# EAGLE design Segway_IMU_v10 (EAGLE 6.2)
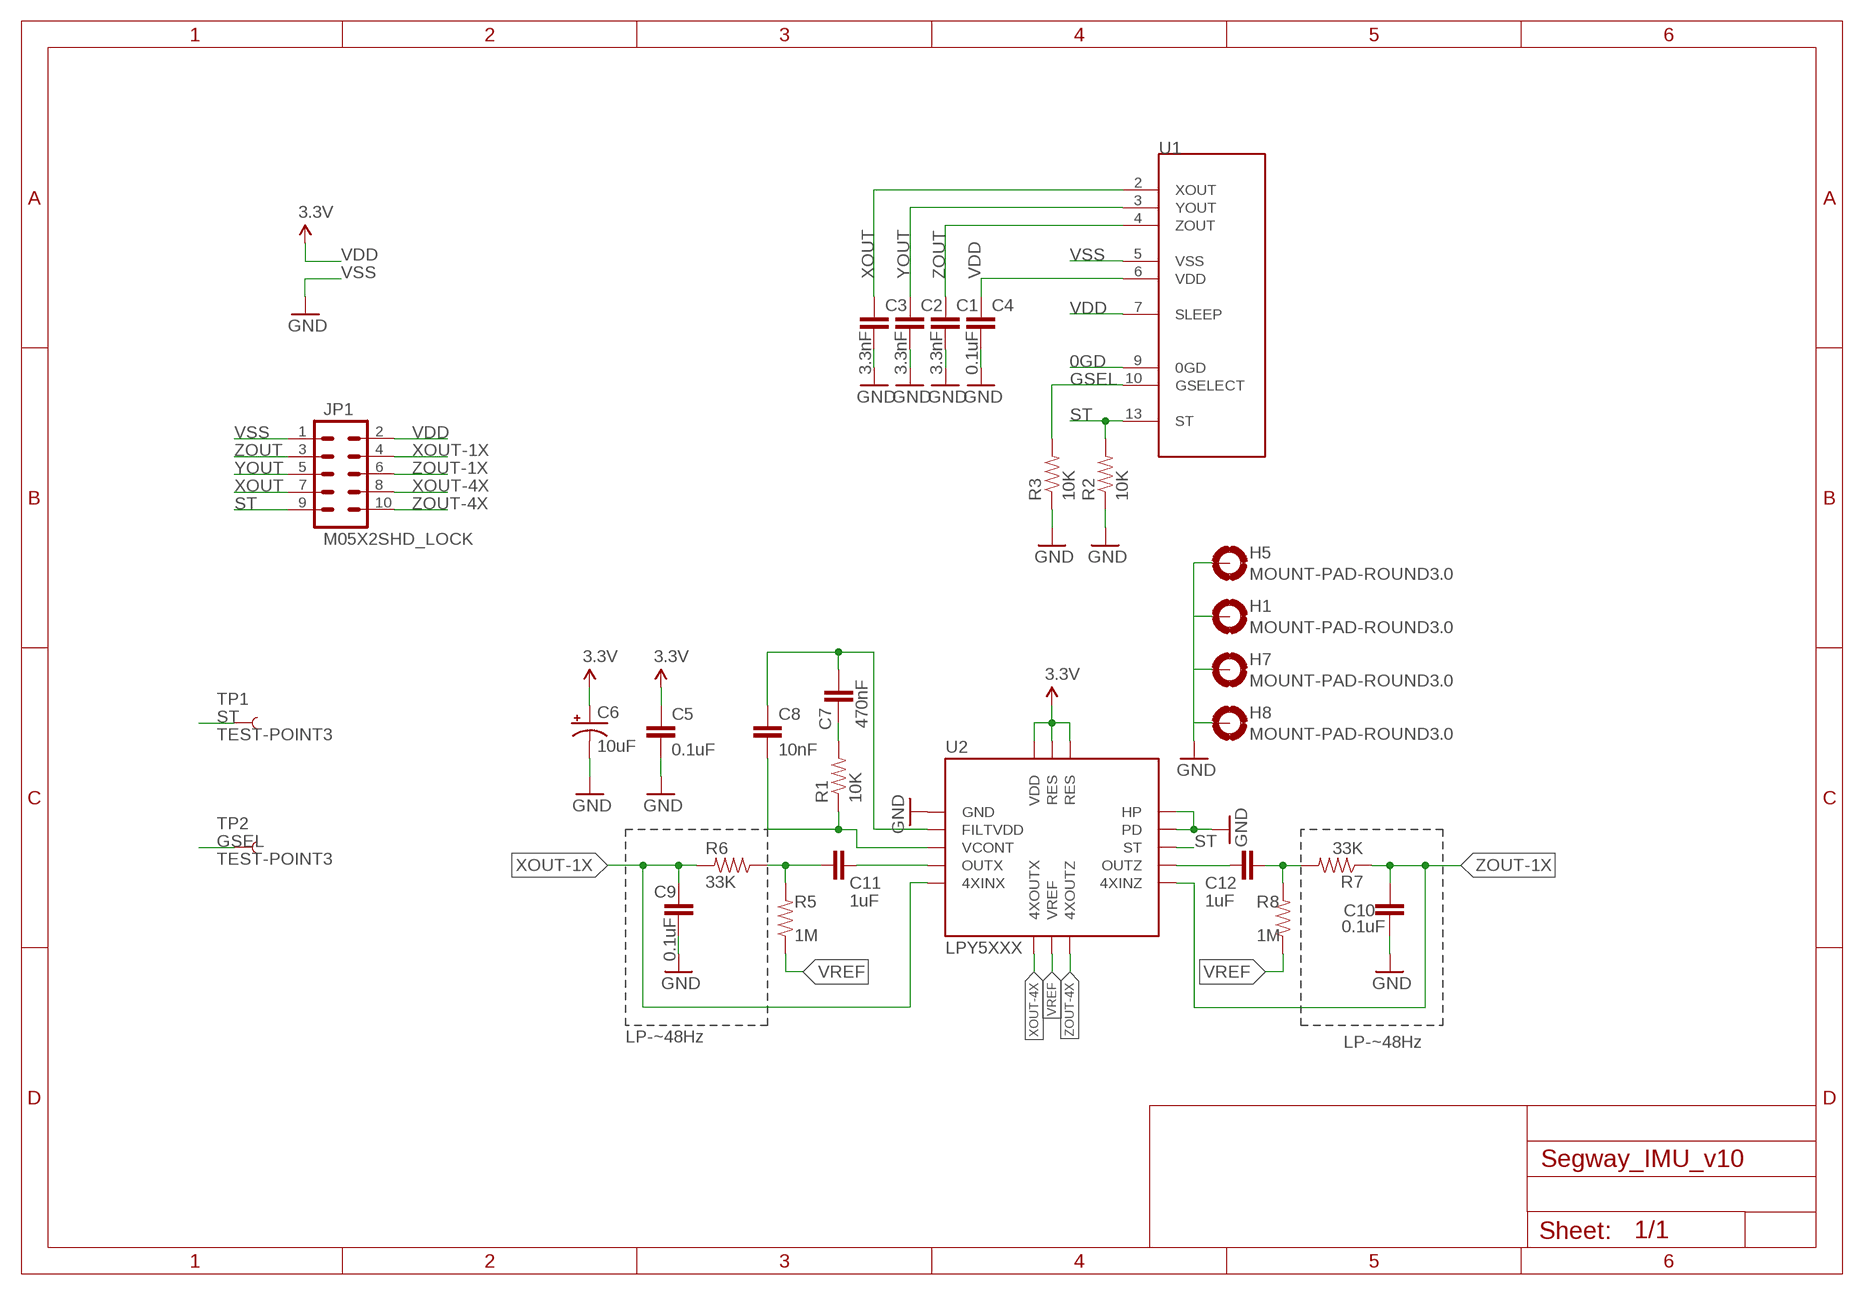
[diagram p0: schematic, sheet 1]

## Parts
C1  3.3nF  CAP0402-CAP  [0402-CAP]
C2  3.3nF  CAP0402-CAP  [0402-CAP]
C3  3.3nF  CAP0402-CAP  [0402-CAP]
C4  0.1uF  CAP0402-CAP  [0402-CAP]
C5  0.1uF  CAP0402-CAP  [0402-CAP]
C6  10uF  CAP_POL1206  [EIA3216]
C7  470nF  CAP0402-CAP  [0402-CAP]
C8  10nF  CAP0402-CAP  [0402-CAP]
C9  0.1uF  CAP0402-CAP  [0402-CAP]
C10  0.1uF  CAP0402-CAP  [0402-CAP]
C11  1uF  CAP0402  [0402]
C12  1uF  CAP0402  [0402]
H1  MOUNT-PAD-ROUND3.0  [3,0-PAD]
H5  MOUNT-PAD-ROUND3.0  [3,0-PAD]
H7  MOUNT-PAD-ROUND3.0  [3,0-PAD]
H8  MOUNT-PAD-ROUND3.0  [3,0-PAD]
JP1  M05X2SHD_LOCK  [2X5-SHROUDED_LOCK]
R1  10K  RESISTOR0402-RES  [0402-RES]
R2  10K  RESISTOR0402-RES  [0402-RES]
R3  10K  RESISTOR0402-RES  [0402-RES]
R5  1M  RESISTOR0402-RES  [0402-RES]
R6  33K  RESISTOR0402-RES  [0402-RES]
R7  33K  RESISTOR0402-RES  [0402-RES]
R8  1M  RESISTOR0402-RES  [0402-RES]
TP1  TEST-POINT3  [PAD.03X.03]
TP2  TEST-POINT3  [PAD.03X.03]
U1  MMA7361  [LGA14]
U2  LPY5XXX  ST-GYRO-PYSMD  [ST-GYRO]

## Nets
0GD: U1.9(0GD)
F1: C7.1 C8.1 U2.2(FILTVDD)
F2: C8.2 R1.1 U2.3(VCONT)
GSEL: R3.2 TP2.P$1 U1.10(GSELECT)
N$1: C11.2 U2.4(OUTX)
N$2: C10.2
N$6: C11.1 R5.2 R6.1
N$7: C7.2 R1.2
N$8: C12.1 U2.10(OUTZ)
N$17: C12.2 R7.2 R8.2
ST: JP1.9 R2.2 TP1.P$1 U1.13(ST) U2.11(ST)
VDD: C4.1 C5.1 C6.A(+) JP1.2 U1.6(VDD) U1.7(SLEEP) U2.14(RES) U2.15(RES) U2.16(VDD) ; supply symbol labelled 3.3V
VREF: R5.1 R8.1 U2.7(VREF)
VSS: C1.2 C2.2 C3.2 C4.2 C5.2 C6.C(-) C9.1 C10.1 H1.B3,0(MOUNT) H5.B3,0(MOUNT) H7.B3,0(MOUNT) H8.B3,0(MOUNT) JP1.1 R2.1 R3.1 U1.5(VSS) U2.1(GND) U2.12(PD) U2.13(HP) ; supply symbol labelled GND
XOUT: C3.1 JP1.7 U1.2(XOUT)
XOUT-1X: C9.2 JP1.4 R6.2 U2.5(4XINX)
XOUT-4X: JP1.8 U2.6(4XOUTX)
YOUT: C2.1 JP1.5 U1.3(YOUT)
ZOUT: C1.1 JP1.3 U1.4(ZOUT)
ZOUT-1X: JP1.6 R7.1 U2.9(4XINZ)
ZOUT-4X: JP1.10 U2.8(4XOUTZ)

## Notes on the sheet
- LP-~48Hz
- LP-~48Hz

## Library data of the parts
C1-C5 C7-C10 = SparkFun:CAP: Capacitor Standard 0603 ceramic capacitor, and 0.1" leaded capacitor.
C6 = SparkFun:CAP_POL: Capacitor Polarized These are standard SMD and PTH capacitors. Normally 10uF, 47uF, and 100uF in electrolytic and tantalum varieties. Always verify the external diameter of the through hole cap, it varies with capacity, voltage, and manufacturer. The EIA devices should be standard.
C11 C12 = gary:CAP: Capacitor Standard 0603 ceramic capacitor, and 0.1" leaded capacitor.
H1 H5 H7 H8 = holes:MOUNT-PAD-ROUND: MOUNTING PAD, round
JP1 = SparkFun:M05X2: Header 5x2 Standard 10-pin dual row 0.1" header. Commonly used with AVR-ISP. Use with Spark Fun Electronics SKU: PRT-00778
R1-R3 R5-R8 = SparkFun:RESISTOR: Resistor Basic schematic elements and footprints for 0603, 1206, and PTH resistors.
TP1 TP2 = SparkFun:TEST-POINT
U1 = SparkFun:MMA7361
U2 = SparkFun:ST-GYRO-PY

## Board
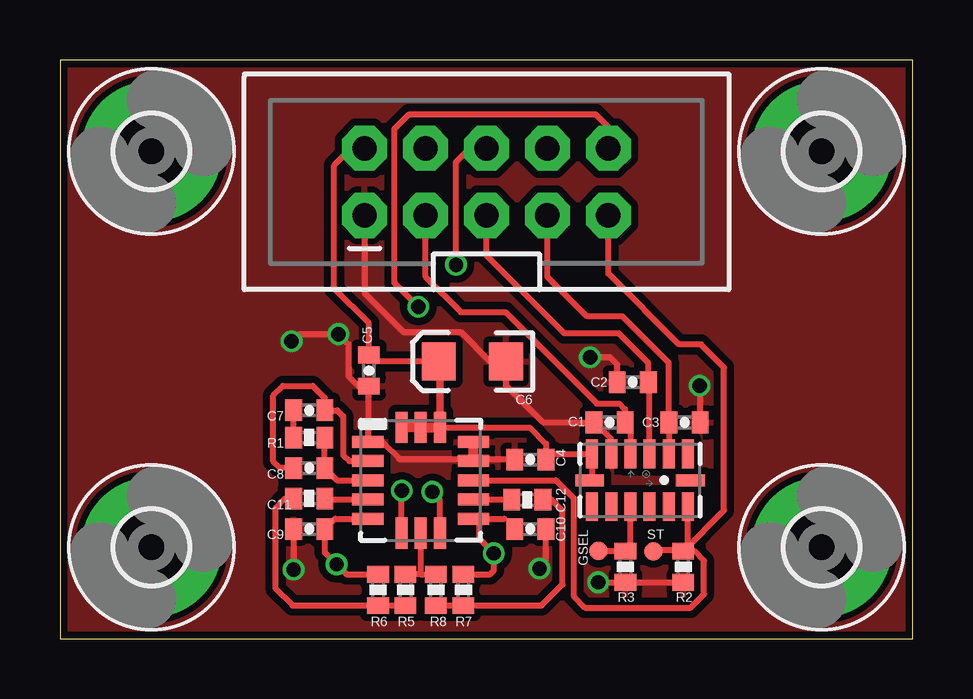
[diagram p1: board, top side]
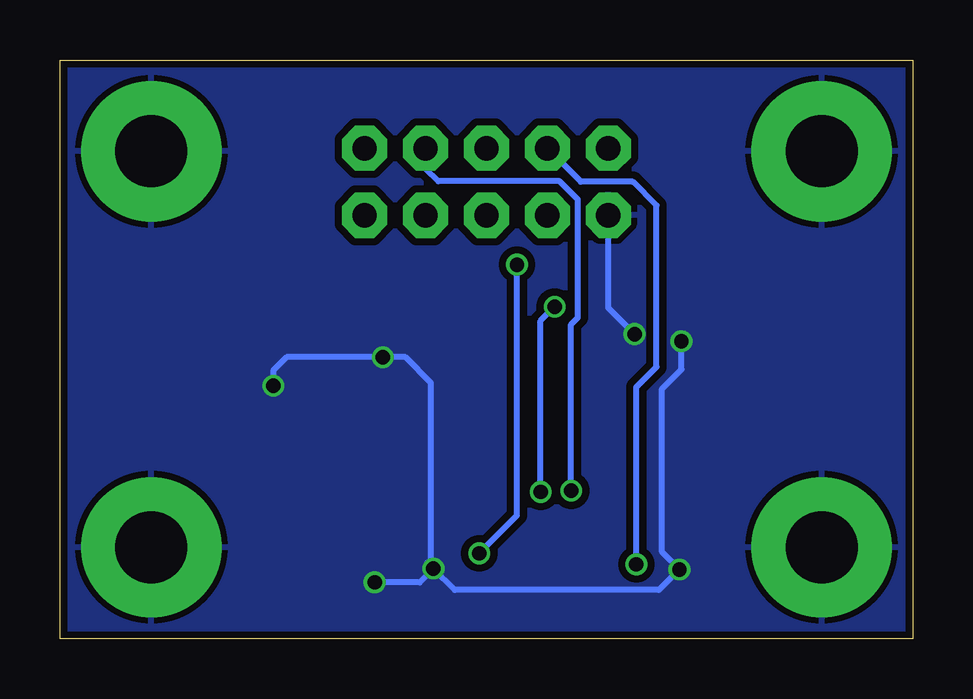
[diagram p2: board, bottom side, seen from below]

Size 35.56 x 24.13 mm. Coordinates in mm from the lower left corner, seen from the top.
Outline: 0,0 35.56,0 35.56,24.13 0,24.13 0,0
Copper layers (1*16): Top 0.035mm / dielectric 1.5mm / Bottom 0.035mm
Design rules: minimum track width 6mil, minimum drill 12mil, track to track 6mil, track to pad 6mil, pad to pad 6mil, via to via 6mil, smd to smd 0mil, copper to edge 10mil, drill to drill 10mil, minimum pad ring 10mil, minimum via ring 6mil, stop-mask expansion 2mil, vias tented up to drill 100mil, thermal gap 10mil

### Footprints (pad centres in the part's own frame; a part is rotated, then mirrored left to right if it is on the bottom)
0402-CAP = smd 0.7 x 0.9: 1 -0.65,0; 2 0.65,0
EIA3216 = smd 1.4 x 1.6: A 1.4,0; C -1.4,0
0402 = smd 0.7 x 0.9: 1 -0.65,0; 2 0.65,0
3,0-PAD = drill 3 pad 5.842: B3,0 0,0
2X5-SHROUDED_LOCK = drill 1.016 pad 1.88 octagon: 1 -1.397,5.08; 2 1.397,5.08; 3 -1.397,2.54; 4 1.397,2.54; 5 -1.397,0; 6 1.397,0; 7 -1.397,-2.54; 8 1.397,-2.54; 9 -1.397,-5.08; 10 1.397,-5.08
0402-RES = smd 0.7 x 0.9: 1 -0.65,0; 2 0.65,0
PAD.03X.03 = smd 0.762 x 0.762: P$1 0,0
LGA14 = smd 0.5 x 1.2: 1 2,1.1; 2 1.2,1.1; 3 0.4,1.1; 4 -0.4,1.1; 5 -1.2,1.1; 6 -2,1.1; 8 -2,-1.1; 9 -1.2,-1.1; 10 -0.4,-1.1; 11 0.4,-1.1; 12 1.2,-1.1; 13 2,-1.1 | smd 1.2 x 0.5: 7 -2.1,0; 14 2.1,0
ST-GYRO = smd 1.3 x 0.5: 1 -2.2,1.6; 2 -2.2,0.8; 3 -2.2,0; 4 -2.2,-0.8; 5 -2.2,-1.6; 9 2.2,-1.6; 10 2.2,-0.8; 11 2.2,0; 12 2.2,0.8; 13 2.2,1.6 | smd 0.5 x 1.3: 6 -0.8,-2.2; 7 0,-2.2; 8 0.8,-2.2; 14 0.8,2.2; 15 0,2.2; 16 -0.8,2.2

### Placement (x,y rotation side)
C1  22.91,9.02 180 top
C2  23.88,10.69 180 top
C3  26.04,9.02 0 top
C4  19.61,7.47 180 top
C5  12.88,11.18 270 top
C6  17.2,11.56 180 top
C7  10.39,9.53 180 top
C8  10.39,7.11 0 top
C9  10.39,4.57 0 top
C10  19.61,4.57 180 top
C11  10.39,5.84 0 top
C12  19.48,5.79 0 top
H1  31.75,20.32 0 top
H5  3.81,20.32 0 top
H7  3.81,3.81 0 top
H8  31.75,3.81 0 top
JP1  17.78,19.05 90 top
R1  10.39,8.38 180 top
R2  25.98,3 90 top
R3  23.57,3 90 top
R5  14.4,2.03 270 top
R6  13.26,2.03 90 top
R7  16.81,2.03 270 top
R8  15.67,2.03 270 top
TP1  24.74,3.65 0 top
TP2  22.45,3.66 0 top
U1  24.18,6.6 0 top
U2  15.04,6.6 0 top

### Tracks (layer width: path | path; a pad name or v marks a point on that pad's centre or on a via)
F1
  Top 0.254: C7.1 11.02,9.54 | U2.2 12.05,7.4 11.81,7.64 11.81,9.27 11.56,9.53 C7.1 | C7.1 11.04,10.04 10.54,10.54 9.3,10.54 8.89,10.13 8.89,7.39 9.17,7.11 C8.1
F2
  Top 0.254: R1.1 C8.2 11.55,6.6 U2.3
GSEL
  Top 0.254: R3.2 23.55,3.67 | U1.10 23.78,3.86 R3.2 | TP2.P$1 R3.2
N$1
  Top 0.254: U2.4 11.08,5.8 C11.2
N$6
  Top 0.254: R5.2 R6.1 9.69,1.38 8.99,2.08 8.99,5.46 9.37,5.84 C11.1
N$7
  Top 0.254: R1.2 C7.2
N$8
  Top 0.254: 18.95,5.8 C12.1 18.82,5.8 U2.10
N$17
  Top 0.254: R8.2 R7.2 20.08,1.38 20.95,2.26 20.95,5.33 20.5,5.79 C12.2
ST
  Top 0.254: R2.2 | R2.2 25.95,3.68 24.77,3.68 TP1.P$1 | U1.13 26.18,3.84 26,3.66 | 26,3.66 R2.2 | U2.11 20.68,6.6 21.41,5.87 21.41,1.78 21.89,1.29 26.29,1.29 26.85,1.85 26.85,3.25 26.44,3.66 26,3.66 | JP1.9 22.86,15.21 25.81,12.27 26.72,12.27 27.69,11.3 27.69,5.35 R2.2
VDD
  Top 0.254: 15.8,8.84 U2.14 19.59,8.8 20.27,8.13 C4.1 20.5,7.7 U1.6 22.18,6.7 U1.7 | C6.A 13.15,11.56 C5.1 12.88,13.16 11.43,14.61 11.43,19.74 12.14,20.45 JP1.2
  Top 0.305: C6.A 15.84,11.56 U2.14
  Top 0.406: U2.16 U2.15 U2.14
VREF
  Top 0.254: 15.04,2.68 R8.1 | 15.04,2.68 R5.1 | U2.7 15.04,2.68
VSS  (via drill 0.6)
  Top 0.254: 16.94,7.49 14.15,7.49 13.44,8.2 U2.1 12.84,10.48 C5.2 12.44,10.53 12.04,10.92 12.04,12.27 v11.61,12.7 9.96,12.7 v9.65,12.39 | 16.94,7.49 17.15,7.49 | R3.1 R2.1 | 16.94,7.49 17.03,7.4 U2.12 17.33,7.49 18.93,7.49 C4.2 | R3.1 23.56,2.36 | C10.1 20.26,3.19 v19.99,2.92 | v22.44,2.35 R3.1 | 26.72,9.05 C3.2 26.68,10.53 v26.67,10.54 | U1.5 22.98,8.3 C1.2 20.14,9.02 18.59,10.57 C6.C 17.93,11.56 16.71,12.78 14.33,12.78 12.7,14.4 JP1.1 | C2.2 23.23,11.45 22.94,11.73 v22.1,11.73 | C9.1 v9.74,2.88
  Top 0.406: U2.12 U2.13
  Bottom 0.254: v19.99,2.92 19.1,2.03 10.59,2.03 v9.74,2.88 10.46,3.61 10.46,10.41 9.65,11.23 v9.65,12.39 | v19.99,2.92 20.24,3.17 | v19.99,2.92 20.09,3.02 20.09,10.67 21.16,11.73 v22.1,11.73 26.11,11.73 26.67,11.18 v26.67,10.54 | JP1.1 12.7,13.79 v11.61,12.7 | v22.44,2.35 20.56,2.35 v19.99,2.92
  pour Top (isolate 0.305): 0,24.13 35.56,24.13 35.56,0 0,0
  pour Bottom (isolate 0.305): 0,24.13 35.56,24.13 35.56,0 0,0
XOUT
  Top 0.254: C3.1 U1.2 | C3.1 | C3.1 25.38,11.5 23.44,13.44 21.97,13.44 20.32,15.09 JP1.7
XOUT-1X  (via drill 0.6)
  Top 0.254: C9.2 11.16,4.69 | U2.5 11.47,5 C9.2 | R6.2 11.95,2.68 v11.53,3.1 11.04,3.59 C9.2
  Bottom 0.254: JP1.4 13.84,19.05 11.68,19.05 10.69,18.06 10.69,11.33 11.53,10.49 v11.53,3.1
XOUT-4X  (via drill 0.6)
  Top 0.254: U2.6 14.24,6.16 v14.25,6.17
  Bottom 0.254: JP1.8 20.32,19.61 19.79,19.07 14.73,19.07 13.97,18.31 13.97,13.39 14.25,13.11 v14.25,6.17
YOUT
  Top 0.254: U1.3 24.58,10.49 C2.1 24.53,11.49 23.29,12.72 21.03,12.72 17.78,15.98 JP1.5
ZOUT
  Top 0.254: U1.4 23.78,8.8 C1.1 | C1.1 23.57,9.03 | C1.1 23.56,9.56 23.32,9.8 22.38,9.8 18.57,13.61 16.71,13.61 15.24,15.09 JP1.3
ZOUT-1X  (via drill 0.6)
  Top 0.254: 17.48,5 U2.9 | 17.48,5 17.48,4.16 v18.09,3.56 18.09,2.85 17.92,2.68 R7.1 | 17.48,5 18.53,5 | v16.51,15.6 16.51,19.86 17.09,20.45 JP1.6
  Bottom 0.254: v16.51,15.6 16.51,5.13 v18.09,3.56
ZOUT-4X  (via drill 0.6)
  Top 0.254: v14.94,13.84 13.95,14.83 13.95,21.26 14.55,21.87 22.33,21.87 22.86,21.34 JP1.10 | U2.8 15.84,5.8 v15.52,6.12
  Bottom 0.254: v15.52,6.12 15.52,13.26 v14.94,13.84

### Text on the board
tNames: ST | GSEL
tValues: Y+ | X+ | x+
bDocu: IMU BOARD | Rev. A | June 2011